# EAGLE design cap_res_v1.0 (EAGLE 9.5.1)
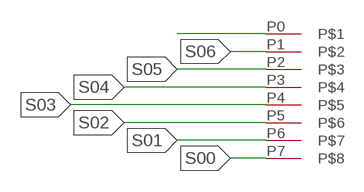
[diagram p0: schematic, sheet 1]

## Parts
U$1  CAPRES_PADS  [CAPRES_PADS]

## Nets
S00: U$1.P7
S01: U$1.P6
S02: U$1.P5
S03: U$1.P4
S04: U$1.P3
S05: U$1.P2
S06: U$1.P1
S07: U$1.P0

## Library data of the parts
U$1 = connectors:CAPRES_PADS

## Net classes
0 default: width 0.152 mm, clearance 0.203 mm
2 distance: width 0.152 mm, clearance 0.4 mm
3 RX: clearance 1 mm to class 0, clearance 1 mm

## Board
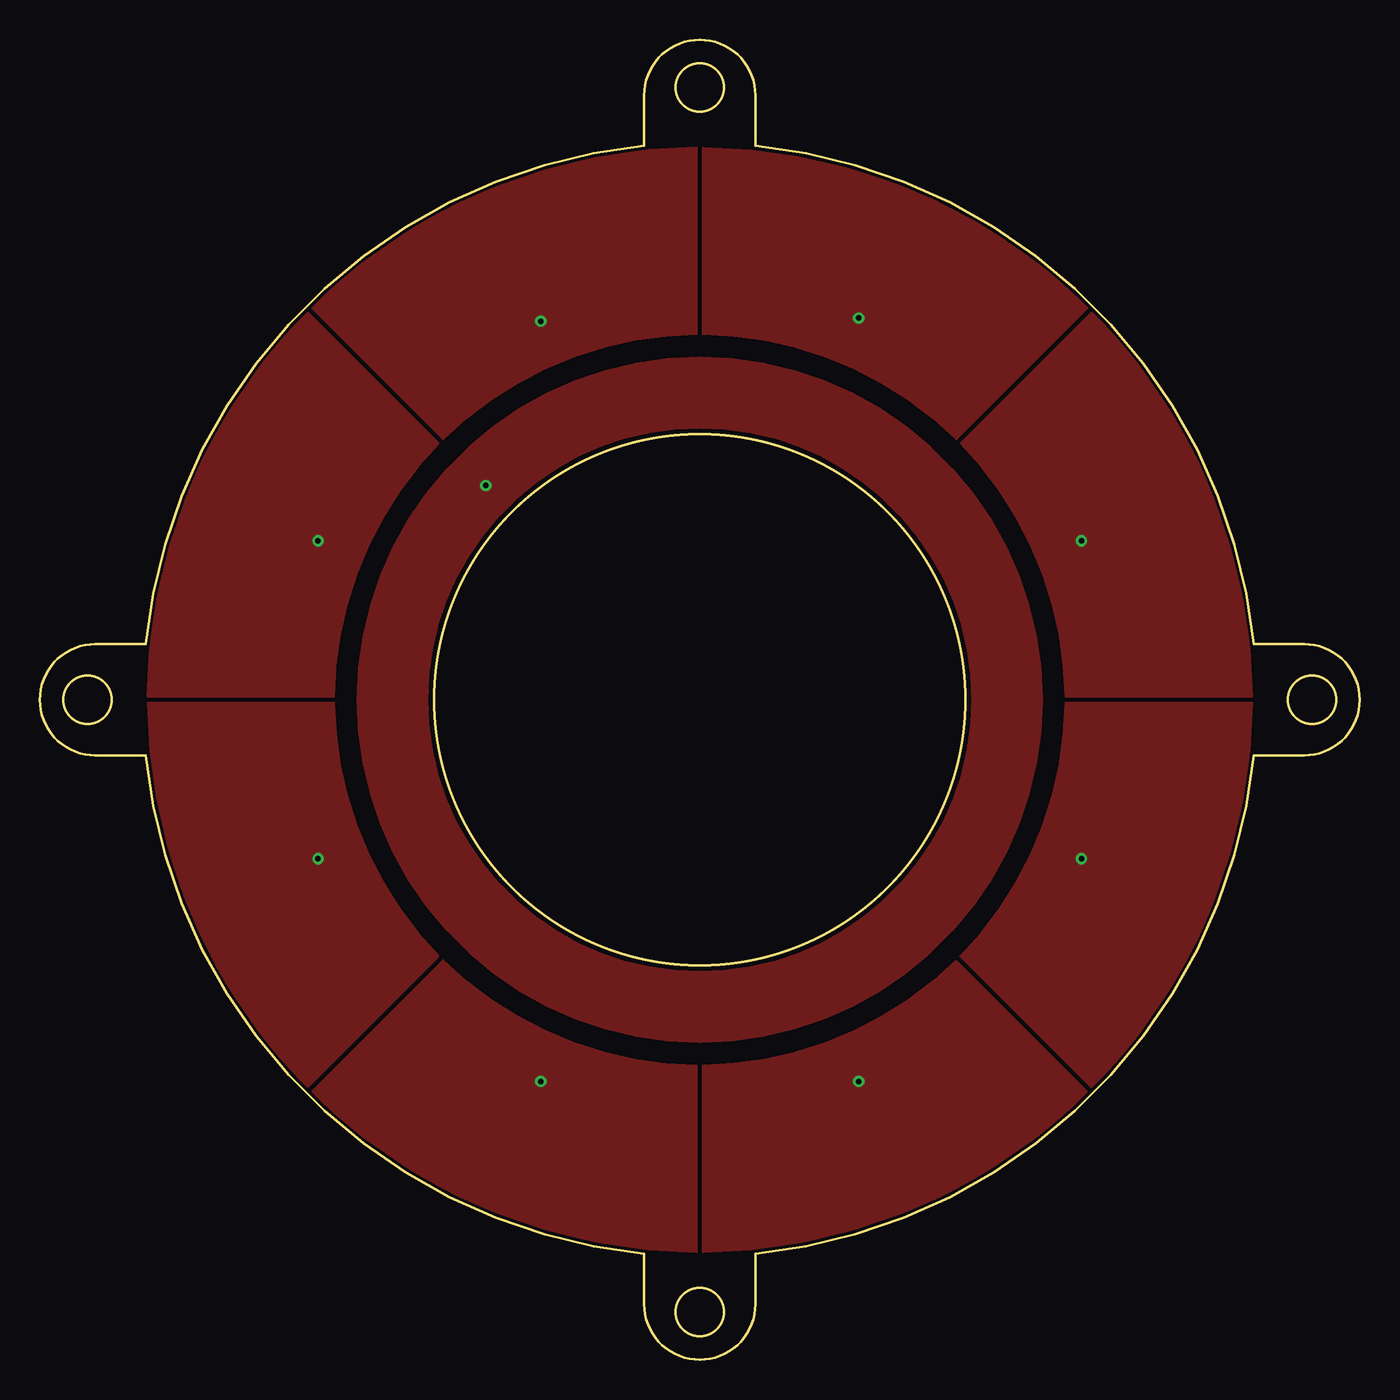
[diagram p1: board, top side]
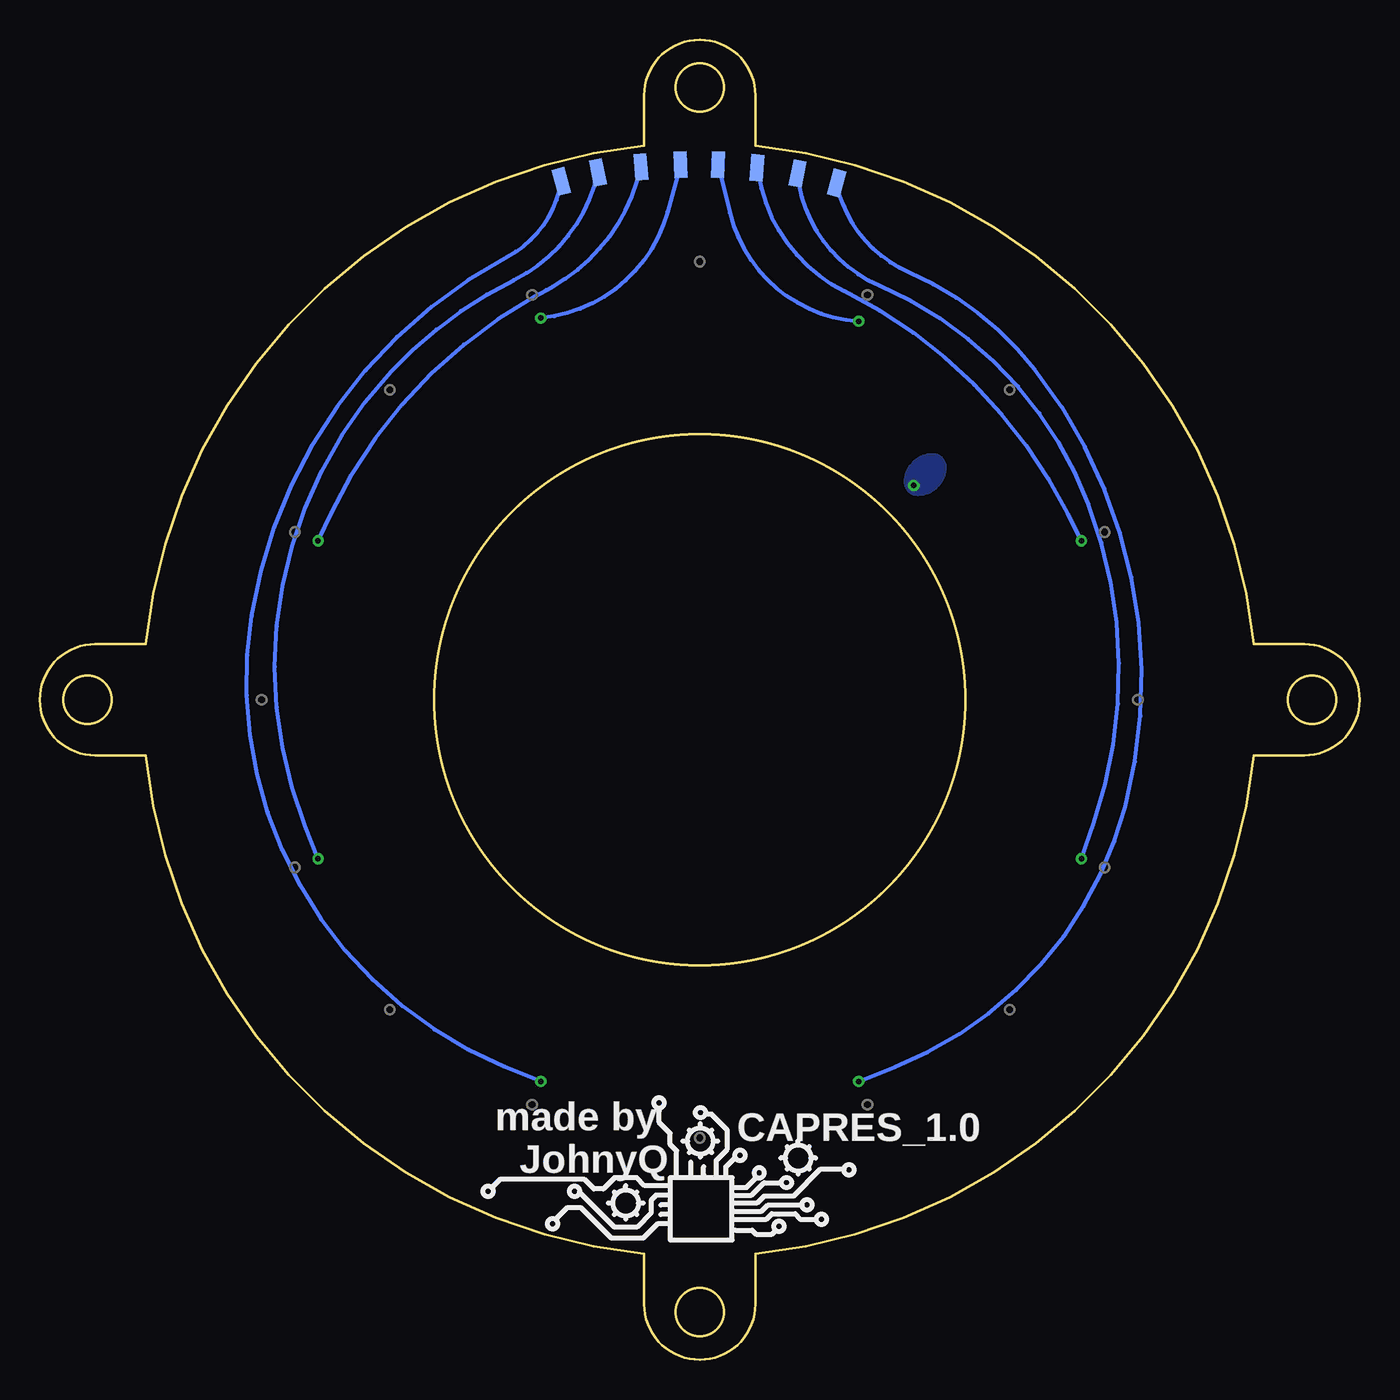
[diagram p2: board, bottom side, seen from below]

Size 83 x 83 mm. Coordinates in mm from the lower left corner, seen from the top.
Outline: 38,76.33 38,79.5 arc-90 41.5,83 arc-90 45,79.5 45,76.33 arc-78 76.33,45 79.5,45 arc-90 83,41.5 arc-90 79.5,38 76.33,38 arc-78 45,6.67 45,3.5 arc-90 41.5,0 arc-90 38,3.5 38,6.67 arc-78 6.67,38 3.5,38 arc-90 0,41.5 arc-90 3.5,45 6.67,45 arc-78 38,76.33
Outline: circle at 41.5,41.5 radius 16.7
Outline: circle at 41.5,80 radius 1.5
Outline: circle at 80,41.5 radius 1.5
Outline: circle at 3,41.5 radius 1.5
Outline: circle at 41.5,3 radius 1.5
Copper layers (1+2*15+16): Top 0.035559375mm / dielectric 0.47751875mm / Route2 0.035559375mm / dielectric 0.47751875mm / Route15 0.035559375mm / dielectric 0.47751875mm / Bottom 0.035559375mm
Design rules "SparkFun-4-Layer-General-JLCPCB": minimum track width 7mil, minimum drill 12mil, track to track 7mil, track to pad 7mil, pad to pad 7mil, via to via 7mil, smd to smd 7mil, copper to edge 7mil, drill to drill 7mil, minimum pad ring 7mil, minimum via ring 7mil, stop-mask expansion 3mil, vias tented up to drill 25mil, thermal gap 10mil

### Footprints (pad centres in the part's own frame; a part is rotated, then mirrored left to right if it is on the bottom)
CAPRES_PADS = smd 1.676 x 0.813 rotated 88: P0 1.15,0.4 | smd 1.676 x 0.813 rotated 85: P1 3.6,0.2 | smd 1.676 x 0.813 rotated 79: P2 6.15,-0.15 | smd 1.676 x 0.813 rotated 75: P3 8.6,-0.75 | smd 1.676 x 0.813 rotated 285: P4 -8.7,-0.65 | smd 1.676 x 0.813 rotated 281: P5 -6.4,-0.1 | smd 1.676 x 0.813 rotated 275: P6 -3.7,0.25 | smd 1.676 x 0.813 rotated 92: P7 -1.2,0.4

### Placement (x,y rotation side)
U$1  41.5,74.75 0 bottom

### Tracks (layer width: path | path; a pad name or v marks a point on that pad's centre or on a via)
GND
  cutout Top: 41.5,58.5 arc90 24.5,41.5 arc90 41.5,24.5 arc90 58.5,41.5 arc90
RX  (via drill 0.35)
  Bottom 0.254: v28.05,54.97 28.03,54.97
  pour Top (isolate 0.254, rank 2): 41.5,63 arc90 20,41.5 arc90 41.5,20 arc90 63,41.5 arc90
  pour Bottom: 26.85,56.93 arc90 26.05,56.13 arc90 27.8,54.38 arc90 28.59,55.19 arc90
S00  (via drill 0.35)
  Bottom 0.254: U$1.P7 43.53,72.16 arc69 v51.5,65.5
  pour Top (rank 4): 41.7,76.19 41.7,64.51 arc-44 57.65,57.88 65.92,66.14 arc44
S01  (via drill 0.35)
  Bottom 0.254: v65.5,51.5 64.65,53.28 arc36 51.84,66.87 arc0 50.78,67.46 arc-48 U$1.P6
  pour Top (rank 5): 76.2,41.7 64.51,41.7 arc44 57.89,57.64 66.16,65.92 arc-44
S02  (via drill 0.35)
  Bottom 0.254: v65.5,31.5 66.32,33.58 arc65 60.89,62.16 arc21 53.18,67.9 arc-51 U$1.P5
  pour Top (rank 4): 76.2,41.3 64.51,41.3 arc-44 57.89,25.36 66.15,17.08 arc44
S03  (via drill 0.35)
  Bottom 0.254: v51.5,17.5 53.76,18.43 arc77 69.67,46.78 arc53 53.58,69.37 arc-53 U$1.P4
  pour Top (rank 5): 41.7,6.8 41.7,18.49 arc44 57.64,25.11 65.92,16.85 arc-44
S04  (via drill 0.35)
  Bottom 0.254: v31.5,17.5 29.22,18.41 arc-53 14.74,34.77 arc-53 20.43,62.27 arc-28 28.32,68.36 arc55 U$1.P3
  pour Top (rank 4): 41.31,6.79 41.31,18.49 arc-44 25.36,25.11 17.08,16.84 arc44
S05  (via drill 0.35)
  Bottom 0.254: v17.5,31.5 16.73,33.74 arc-40 17.05,53.79 arc-46 30.19,67.53 arc61 U$1.P2
  pour Top (rank 5): 6.81,41.3 18.49,41.3 arc44 25.11,25.36 16.85,17.09 arc-44
S06  (via drill 0.35)
  Bottom 0.254: v17.5,51.5 18.34,53.17 arc-37 32.39,67.18 arc60 37.93,75.52 U$1.P1
  pour Top (rank 5): 6.8,41.7 18.49,41.7 arc-44 25.11,57.64 16.85,65.92 arc44
S07  (via drill 0.35)
  Bottom 0.254: U$1.P0 39.6,72.1 arc-72 v31.5,65.3
  pour Top (rank 4): 41.3,76.2 41.3,64.51 arc44 25.36,57.89 17.08,66.15 arc-44

### Text on the board
bPlace: made by / JohnyQ | CAPRES_1.0